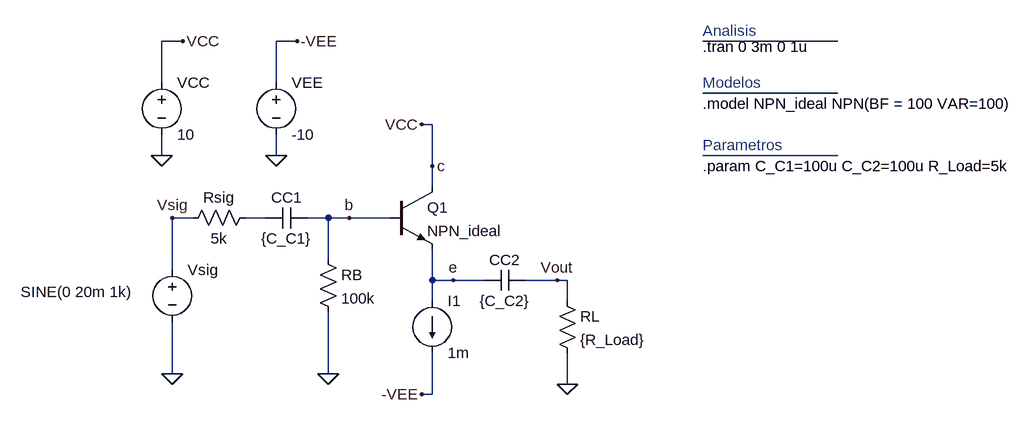
[diagram p0: schematic bjt_cc_time.asc]
bjt_cc_time.asc, the LTspice schematic file:
Version 4
SHEET 1 916 680
WIRE -560 -256 -592 -256
WIRE -384 -256 -416 -256
WIRE 448 -256 240 -256
WIRE -592 -192 -592 -256
WIRE -416 -192 -416 -256
WIRE 448 -176 240 -176
WIRE -176 -128 -192 -128
WIRE -592 -80 -592 -112
WIRE -416 -80 -416 -112
WIRE 448 -80 240 -80
WIRE -176 -64 -176 -128
WIRE -176 -32 -176 -64
WIRE -544 16 -576 16
WIRE -432 16 -464 16
WIRE -336 16 -368 16
WIRE -304 16 -336 16
WIRE -240 16 -304 16
WIRE -336 80 -336 16
WIRE -576 96 -576 16
WIRE -176 112 -176 64
WIRE -144 112 -176 112
WIRE -96 112 -144 112
WIRE 16 112 -32 112
WIRE 32 112 16 112
WIRE -176 144 -176 112
WIRE 32 144 32 112
WIRE -576 256 -576 176
WIRE -336 256 -336 160
WIRE 32 272 32 224
WIRE -176 288 -176 224
WIRE -176 288 -192 288
FLAG -592 -80 0
FLAG -560 -256 VCC
FLAG -576 256 0
FLAG -192 -128 VCC
FLAG 16 112 Vout
FLAG -192 288 -VEE
FLAG -336 256 0
FLAG -416 -80 0
FLAG -384 -256 -VEE
FLAG 32 272 0
FLAG -576 16 Vsig
FLAG -304 16 b
FLAG -176 -64 c
FLAG -144 112 e
SYMBOL npn -240 -32 R0
SYMATTR InstName Q1
SYMATTR Value NPN_ideal
SYMBOL res -352 64 R0
SYMATTR InstName RB
SYMATTR Value 100k
SYMBOL voltage -592 -208 R0
WINDOW 123 0 0 Left 0
WINDOW 39 0 0 Left 0
SYMATTR InstName VCC
SYMATTR Value 10
SYMBOL voltage -576 80 R0
WINDOW 3 -233 50 Left 2
WINDOW 123 0 0 Left 0
WINDOW 39 0 0 Left 0
SYMATTR Value SINE(0 20m 1k)
SYMATTR InstName Vsig
SYMBOL current -176 144 R0
WINDOW 123 0 0 Left 0
WINDOW 39 0 0 Left 0
SYMATTR InstName I1
SYMATTR Value 1m
SYMBOL cap -368 0 R90
WINDOW 0 0 32 VBottom 2
WINDOW 3 32 32 VTop 2
SYMATTR InstName CC1
SYMATTR Value {C_C1}
SYMBOL cap -32 96 R90
WINDOW 0 0 32 VBottom 2
WINDOW 3 32 32 VTop 2
SYMATTR InstName CC2
SYMATTR Value {C_C2}
SYMBOL res -448 0 R90
WINDOW 0 0 56 VBottom 2
WINDOW 3 32 56 VTop 2
SYMATTR InstName Rsig
SYMATTR Value 5k
SYMBOL voltage -416 -208 R0
WINDOW 123 0 0 Left 0
WINDOW 39 0 0 Left 0
SYMATTR InstName VEE
SYMATTR Value -10
SYMBOL res 16 128 R0
SYMATTR InstName RL
SYMATTR Value {R_Load}
TEXT 240 -272 Left 2 ;Analisis
TEXT 240 -248 Left 2 !.tran 0 3m 0 1u
TEXT 240 -160 Left 2 !.model NPN_ideal NPN(BF = 100 VAR=100)
TEXT 240 -192 Left 2 ;Modelos
TEXT 240 -64 Left 2 !.param C_C1=100u C_C2=100u R_Load=5k
TEXT 240 -96 Left 2 ;Parametros

The netlist it stands for:
* bjt_cc_time.asc
Q1 c b e 0 NPN_ideal
RB b 0 100k
VCC c 0 10
Vsig Vsig 0 SINE(0 20m 1k)
I1 e -VEE 1m
CC1 b N004 {C_C1}
CC2 Vout e {C_C2}
Rsig N004 Vsig 5k
VEE -VEE 0 -10
RL Vout 0 {R_Load}
.model NPN NPN
.model PNP PNP
.lib standard.bjt
* Analisis
.tran 0 3m 0 1u
.model NPN_ideal NPN(BF = 100 VAR=100)
* Modelos
.param C_C1=100u C_C2=100u R_Load=5k
* Parametros
.backanno
.end